# EAGLE design RFLED (EAGLE 7.1.0)
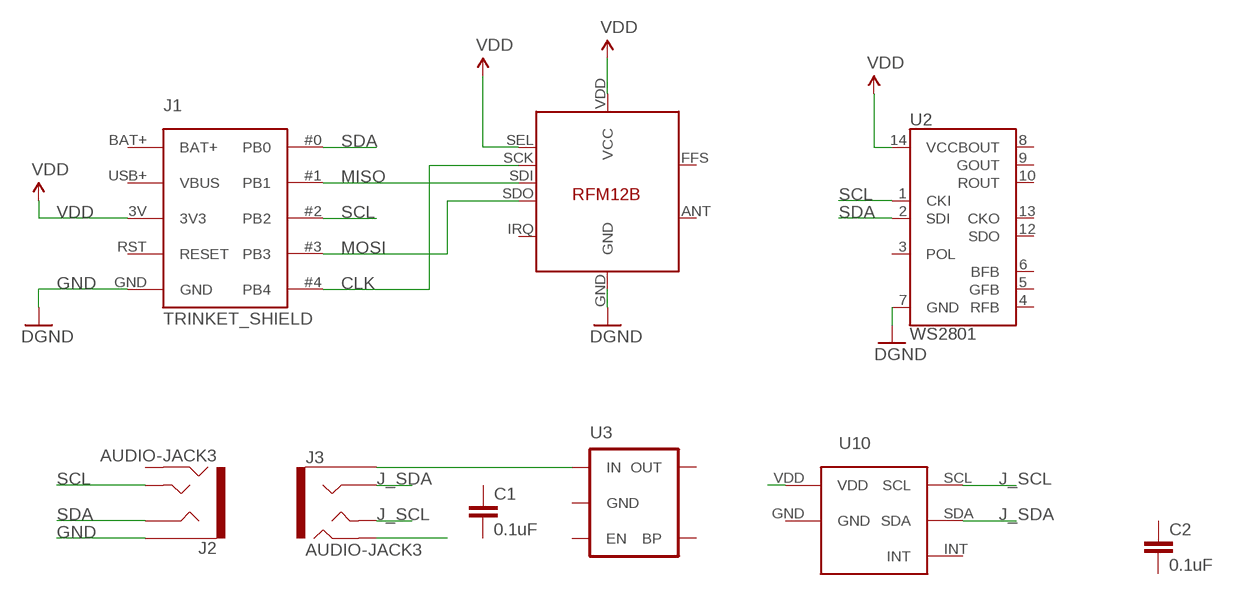
[diagram p0: schematic, sheet 1]

## Parts
C1  0.1uF  0.1UF-25V(+80/-20%)(0603)  [0603-CAP]
C2  0.1uF  0.1UF-25V(+80/-20%)(0603)  [0603-CAP]
J1  TRINKET_SHIELD  [TRINKET_SHIELD]
J2  AUDIO-JACK3  [AUDIO-JACK-TRRS-SMD]
J3  AUDIO-JACK3  [AUDIO-JACK-TRRS-SMD]
U1  RFM12B  [RFM12B]
U2  WS2801  [SOP-14]
U3  MIC52053.3V  [SOT23-5]
U10  TC3472DFNL6_WIDE  [DFNL6_WIDE]

## Nets
CLK: J1.#4(PB4) U1.SCK
GND: J1.GND J2.EARTH U1.GND U2.7(GND) ; supply symbol labelled DGND
J_SCL: J3.TIP U10.SCL
J_SDA: J3.RING1 U10.SDA
J_VDD: J3.RING2
MISO: J1.#1(PB1) U1.SDI
MOSI: J1.#3(PB3) U1.SDO
N$1: J3.EARTH U3.1(IN)
N$2: U10.VDD
SCL: J1.#2(PB2) J2.TIP U2.1(CKI)
SDA: J1.#0(PB0) J2.RING1 U2.2(SDI)
VDD: J1.3V(3V3) U1.SEL U1.VDD(VCC) U2.14(VCC)
Unconnected: C1.1 C1.2 C2.1 C2.2 J1.RST(RESET) J2.RING2 U1.ANT U1.FFS U1.IRQ U2.3(POL) U2.4(RFB) U2.5(GFB) U2.6(BFB) U2.8(BOUT) U2.9(GOUT) U2.10(ROUT) U2.12(SDO) U2.13(CKO) U3.2(GND) U3.3(EN) U3.4(BP) U3.5(OUT) U10.GND U10.INT

## Power pins joined to a net without a drawn wire
BAT+: J1.BAT+
VBUS: J1.USB+(VBUS)

## Library data of the parts
C1 C2 = SparkFun-Capacitors:0.1UF-25V(+80/-20%)(0603): CAP-00810 Ceramic Standard decoupling cap; PROD_ID: CAP-00810
J1 = DZ:TRINKET_SHIELD
J2 J3 = SparkFun-Connectors:AUDIO-JACK3: Audio jack - 3.5mm TRRS variety - two rings.
U1 = JeeParts:RFM12B
U2 = SparkFun-DigitalIC:WS2801: WS2801 3 Channel Constant Current LED Driver with programmable PWM outputs. Datasheet: http://www.sparkfun.com/datasheets/Components/LED/WS2801.pdf
U3 = SparkFun-PowerIC:MIC5205: MIC5205 150mA vreg 3.3V - VREG-00822 5V - VREG-00823; PROD_ID: VREG-00822
U10 = DZ:TC3472: TC3472 Color light-to-digital converter

## Board
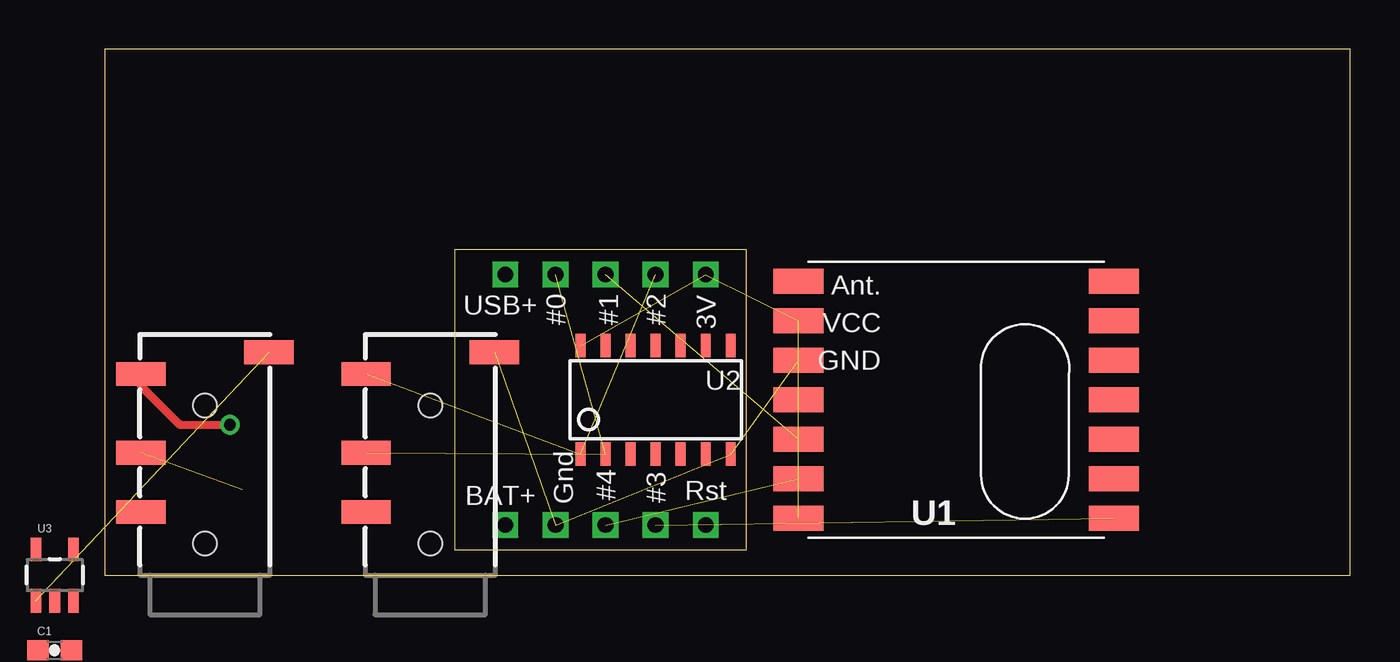
[diagram p1: board, top side]
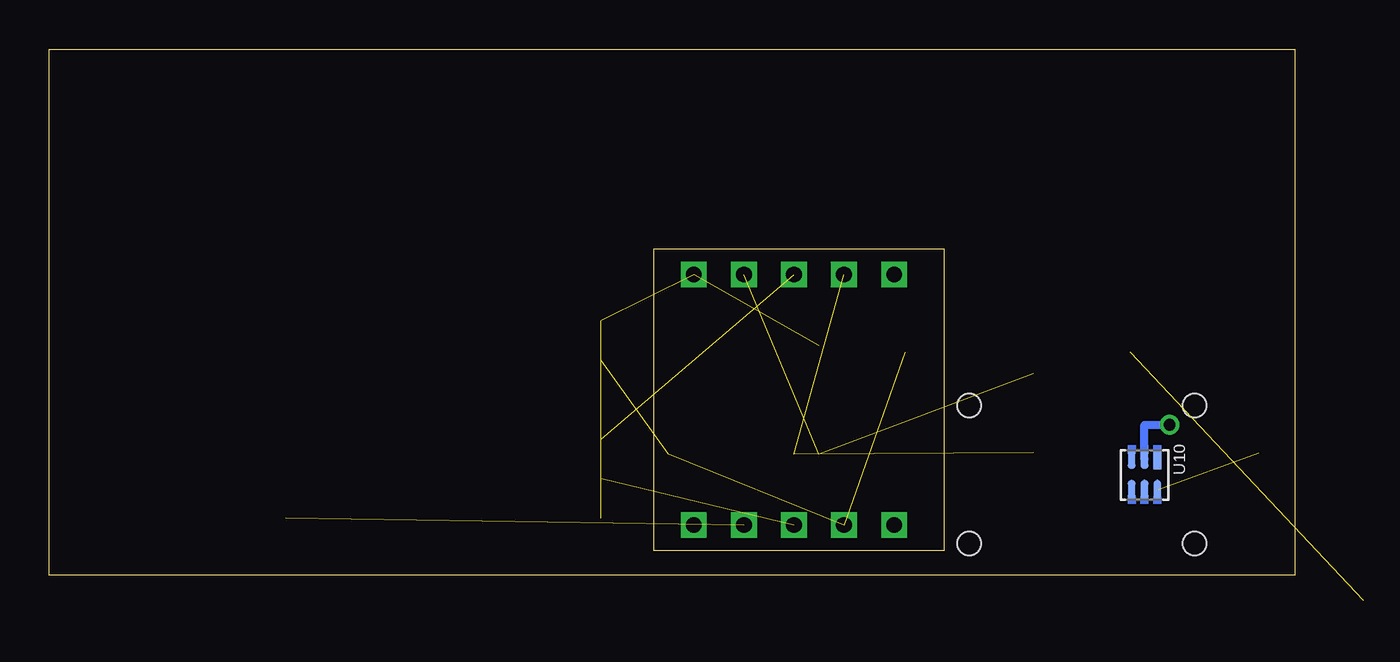
[diagram p2: board, bottom side, seen from below]

Size 63.17 x 26.66 mm. Coordinates in mm from the lower left corner, seen from the top.
Outline: 0,0 63.17,0 63.17,26.66 0,26.66 0,0
Copper layers (1*16): Top 0.035mm / dielectric 1.5mm / Bottom 0.035mm
Design rules "default": minimum track width 10mil, minimum drill 24mil, track to track 8mil, track to pad 8mil, pad to pad 8mil, via to via 8mil, smd to smd 8mil, copper to edge 40mil, drill to drill 8mil, minimum pad ring 10mil, minimum via ring 8mil, stop-mask expansion 4mil, vias tented up to drill 0mil, thermal gap 10mil

### Footprints (pad centres in the part's own frame; a part is rotated, then mirrored left to right if it is on the bottom)
0603-CAP = smd 1.1 x 1: 1 -0.85,0; 2 0.85,0
TRINKET_SHIELD = drill 0.8 square: 3V 5.08,-6.35; #0 5.08,1.27; #1 5.08,-1.27; #2 5.08,-3.81; #3 -7.62,-3.81; #4 -7.62,-1.27; BAT+ -7.62,3.81; GND -7.62,1.27; RST -7.62,-6.35; USB+ 5.08,3.81
AUDIO-JACK-TRRS-SMD = smd 1.2 x 2.5: EARTH 11.3,-3.25; RING1 6.2,3.25; RING2 3.2,3.25; TIP 10.2,3.25 | hole 1.2: 1.6,0; 8.6,0
RFM12B = smd 2.54 x 1.27: ANT 8,-6; FFS -8,2; GND 8,-2; IRQ -8,4; P$8 -8,0; P$9 -8,-2; P$10 -8,-4; P$12 -8,-6; P$16 8,0; SCK 8,4; SDI 8,2; SDO -8,6; SEL 8,6; VDD 8,-4
SOP-14 = smd 0.5 x 1.2: 1 -3.81,-2.75; 2 -2.54,-2.75; 3 -1.27,-2.75; 4 0,-2.75; 5 1.27,-2.75; 6 2.54,-2.75; 7 3.81,-2.75; 8 3.81,2.75; 9 2.54,2.75; 10 1.27,2.75; 11 0,2.75; 12 -1.27,2.75; 13 -2.54,2.75; 14 -3.81,2.75
SOT23-5 = smd 0.55 x 1.2: 1 -0.95,-1.3; 2 0,-1.3; 3 0.95,-1.3; 4 0.95,1.3; 5 -0.95,1.3
DFNL6_WIDE = smd 1 x 0.4: GND -0.8,-0.65; INT 0.75,0; P$6 0.75,-0.65; SCL -0.8,0; SDA 0.75,0.65; VDD -0.8,0.65

### Placement (x,y rotation side)
C1  -2.54,-3.81 0 top  (outside the outline)
C2  -2.54,-7.62 0 top  (outside the outline)
J1  24.13,10.16 90 top
J2  16.51,0 90 top
J3  5.08,0 90 top
U1  43.18,8.89 180 top
U2  27.94,8.89 0 top
U3  -2.54,0 0 top
U10  7.62,5.08 270 bottom

### Tracks (layer width: path | path; a pad name or v marks a point on that pad's centre or on a via)
CLK  (1 unrouted)
GND  (3 unrouted)
J_SCL  (via drill 0.6)
  Top 0.406: J3.TIP 1.83,9.6 3.81,7.62 v6.35,7.62
  Bottom 0.406: U10.SCL 7.62,7.62 v6.35,7.62
J_SDA  (1 unrouted)
MISO  (1 unrouted)
MOSI  (1 unrouted)
N$1  (1 unrouted)
SCL  (2 unrouted)
SDA  (2 unrouted)
VDD  (3 unrouted)